# Altium schematic sheet DM1097_PoE.SchDoc: =project_title (part 1 of 3)
size Tabloid; CompanyName: Luxonis Holding; Organization: Luxonis Holding; Address1: 1925 Harmony Park Drive; Address2: Westminster, CO; Address3: 80234; Address4: United States; SheetNumber: 3; SheetTotal: 12
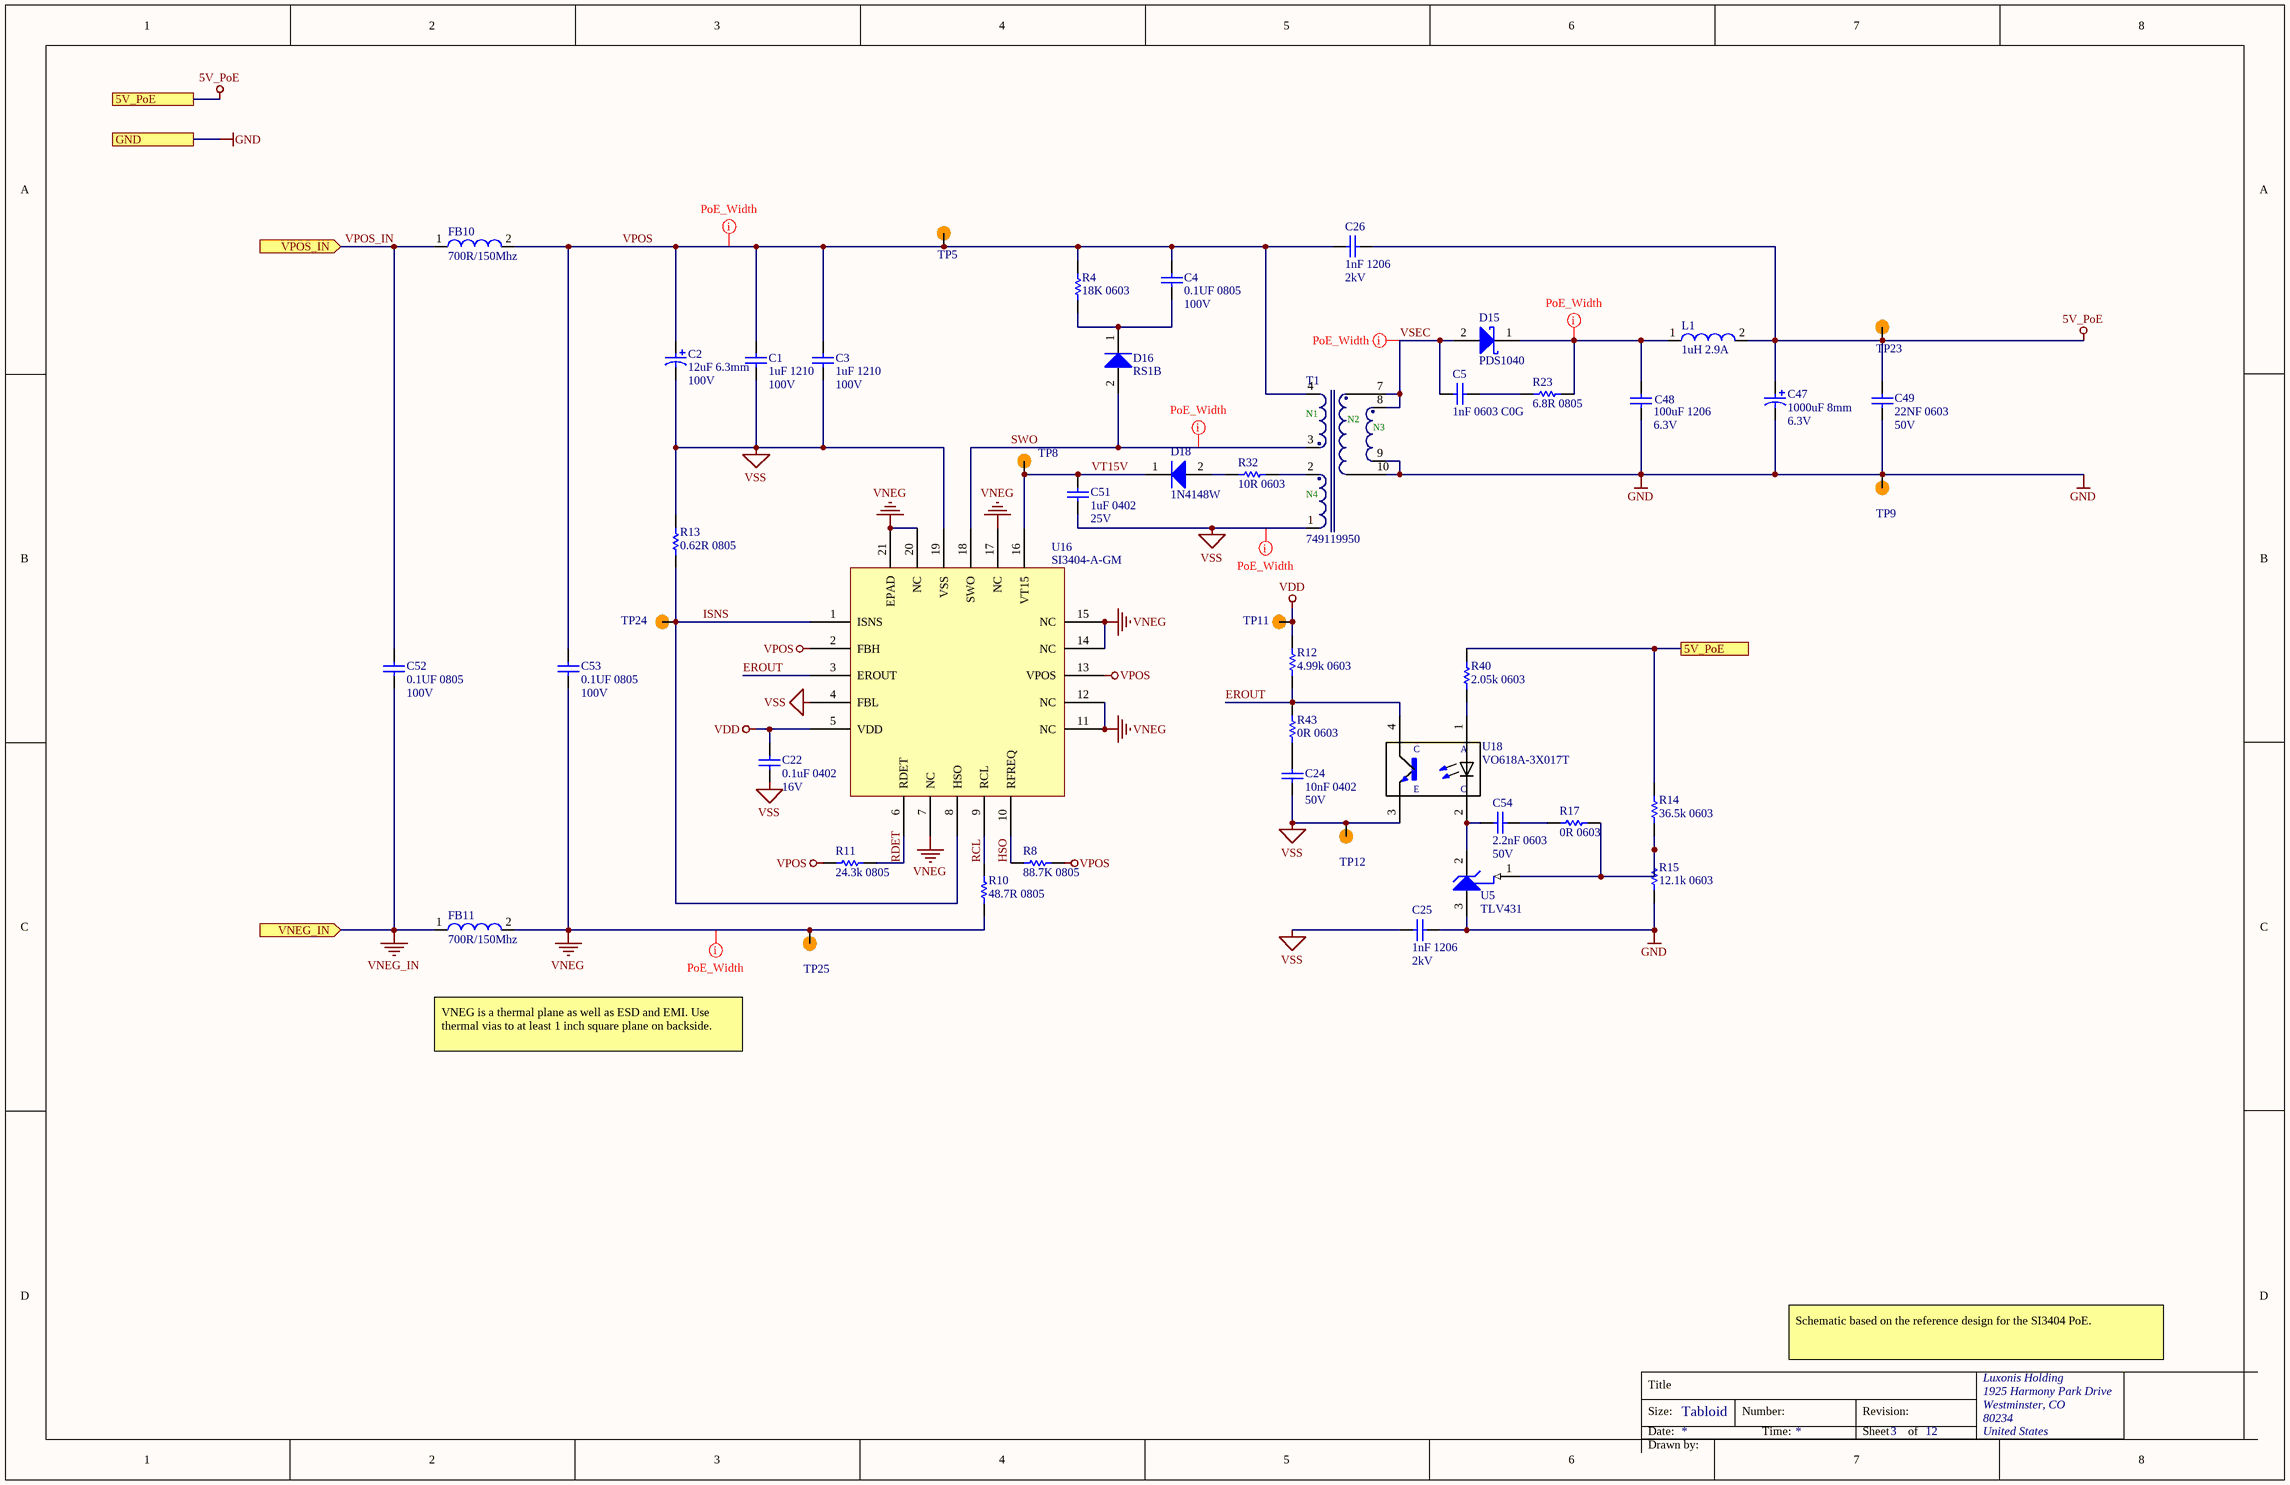
[diagram p0: DM1097_PoE.SchDoc]

## Parts
C1  1uF 1210  Voltage Rating: 100V  [CAPC1210(3225)280_N]
C2  12uF 6.3mm  Voltage: 100V  [EEU-FC2A120]
C3  1uF 1210  Voltage Rating: 100V  [CAPC1210(3225)280_N]
C4  0.1UF 0805  Voltage Rating: 100V  [CAPC0805(2012)145_N]
C5  1nF 0603 C0G  [CAPC0603(1608)100_N]
C22  0.1uF 0402  Voltage Rating: 16V  [CAPC0402(1005)60_N]
C24  10nF 0402  Voltage Rating: 50V  [CAPC0402(1005)60_N]
C25  1nF 1206  Voltage Rating (DC): 2kV  [CAPC1206(3216)190_N]
C26  1nF 1206  Voltage Rating (DC): 2kV  [CAPC1206(3216)190_N]
C47  1000uF 8mm  Voltage: 6.3V  [ECA-0JM102]
C48  100uF 1206  Voltage: 6.3V  [CAPC1206(3216)190_N]
C49  22NF 0603  Voltage: 50V  [CAPC0603(1608)100_N]
C51  1uF 0402  Voltage Rating: 25V  [CAPC0402(1005)70_N]
C52  0.1UF 0805  Voltage Rating: 100V  [CAPC0805(2012)145_N]
C53  0.1UF 0805  Voltage Rating: 100V  [CAPC0805(2012)145_N]
C54  2.2nF 0603  Voltage: 50V  [CAPC0603(1608)100_N]
D15  PDS1040  [PDS1040-13]
D16  RS1B  [RS1B]
D18  1N4148W  [1N4148W-7-F]
FB10  700R/150Mhz  [742792040]
FB11  700R/150Mhz  [742792040]
L1  1uH 2.9A  [DO1608C-102MLx]
R4  18K 0603  [RESC0603(1608)_N]
R8  88.7K 0805  [RESC0805(2012)_N]
R10  48.7R 0805  [RESC0805(2012)_N]
R11  24.3k 0805  [RESC0805(2012)_N]
R12  4.99k 0603  [RESC0603(1608)_N]
R13  0.62R 0805  [RESC0805(2012)_N]
R14  36.5k 0603  [RESC0603(1608)_N]
R15  12.1k 0603  [RESC0603(1608)_N]
R17  0R 0603  [RESC0603(1608)_N]
R23  6.8R 0805  [RESC0805(2012)_N]
R32  10R 0603  [RESC0603(1608)_N]
R40  2.05k 0603  [RESC0603(1608)_N]
R43  0R 0603  [RESC0603(1608)_N]
T1  749119950  [749119950]
TP5  TP100_200_NS  [TP100_200_NS]  (value not drawn)  (no BOM)
TP8  TP100_200_NS  [TP100_200_NS]  (value not drawn)  (no BOM)
TP9  TP100_200_NS  [TP100_200_NS]  (value not drawn)  (no BOM)
TP11  TP100_200_NS  [TP100_200_NS]  (value not drawn)  (no BOM)
TP12  TP100_200_NS  [TP100_200_NS]  (value not drawn)  (no BOM)
TP23  TP100_200_NS  [TP100_200_NS]  (value not drawn)  (no BOM)
TP24  TP100_200_NS  [TP100_200_NS]  (value not drawn)  (no BOM)
TP25  TP100_200_NS  [TP100_200_NS]  (value not drawn)  (no BOM)
U5  TLV431  [TLV431BCDBZR]
U16  SI3404-A-GM  [Si3404-A-GM]
U18  VO618A-3X017T  [VO618A-3X017T]

## Ports
5V_PoE, GND, VNEG_IN (in), VPOS_IN (in)

## Nets
5V_PoE: C26.2 C47.1 C49.2 L1.2 R14.2 R40.2 TP23.1 ; port 5V_PoE
GND: C25.2 C47.2 C48.1 C49.1 R15.1 T1.9 T1.10 TP9.1 U5.3(ANODE) ; port GND
VDD: C22.2 R12.2 TP11.1 U16.5(VDD)
VNEG: C53.1 FB11.2 R10.1 TP25.1 U16.7(NC) U16.11(NC) U16.12(NC) U16.14(NC) U16.15(NC) U16.17(NC) U16.20(NC) U16.21(EPAD)
VNEG_IN: C52.1 FB11.1 ; port VNEG_IN
VPOS: C1.2 C2.1 C3.2 C4.2 C26.1 C53.2 FB10.2 R4.2 R8.1 R11.2 T1.4 TP5.1 U16.2(FBH) U16.13(VPOS)
VSS: C1.1 C2.2 C3.1 C22.1 C24.1 C25.1 C51.1 R13.2 T1.1 TP12.1 U16.4(FBL) U16.19(VSS) U18.3(E)
EROUT: R12.1 R43.2 U16.3(EROUT) U18.4(CO)
HSO: R8.2 U16.10(RFREQ)
ISNS: R13.1 TP24.1 U16.1(ISNS) U16.8(HSO)
RCL: R10.2 U16.9(RCL)
RDET: R11.1 U16.6(RDET)
SWO: D16.2(A) T1.3 U16.18(SWO)
VPOS_IN: C52.2 FB10.1 ; port VPOS_IN
VSEC: C5.2 D15.2(A) T1.7 T1.8
VT15V: C51.2 D18.1(K) TP8.1 U16.16(VT15)
NetC4_1: C4.1 D16.1(K) R4.1
NetC5_1: C5.1 R23.1
NetC24_2: C24.2 R43.1
NetC48_2: C48.2 D15.1(K) L1.1 R23.2
NetC54_1: C54.1 U5.2(CATHODE) U18.2(C)
NetC54_2: C54.2 R17.2
NetD18_2: D18.2(A) R32.1
NetR14_1: R14.1 R15.2 R17.1 U5.1(REF)
NetR32_2: R32.2 T1.2
NetR40_1: R40.1 U18.1(A)

## Layout directives
rule Width Constraint [Pref Width = 15mil    Min Width = 4mil    Max Width = 50mil]; net class PoE: NetC48_2, SWO, VNEG, VPOS, VSEC, VSS

## Notes on the sheet
- VNEG is a thermal plane as well as ESD and EMI. Use thermal vias to at least 1 inch square plane on backside.
- Schematic based on the reference design for the SI3404 PoE.
- Title
- Size:
- Date:
- Tabloid
- Number:
- Time:
- Revision:
- Sheet
- of
- Drawn by:
- (in symbol 749119950) N1; N2; N3; N4